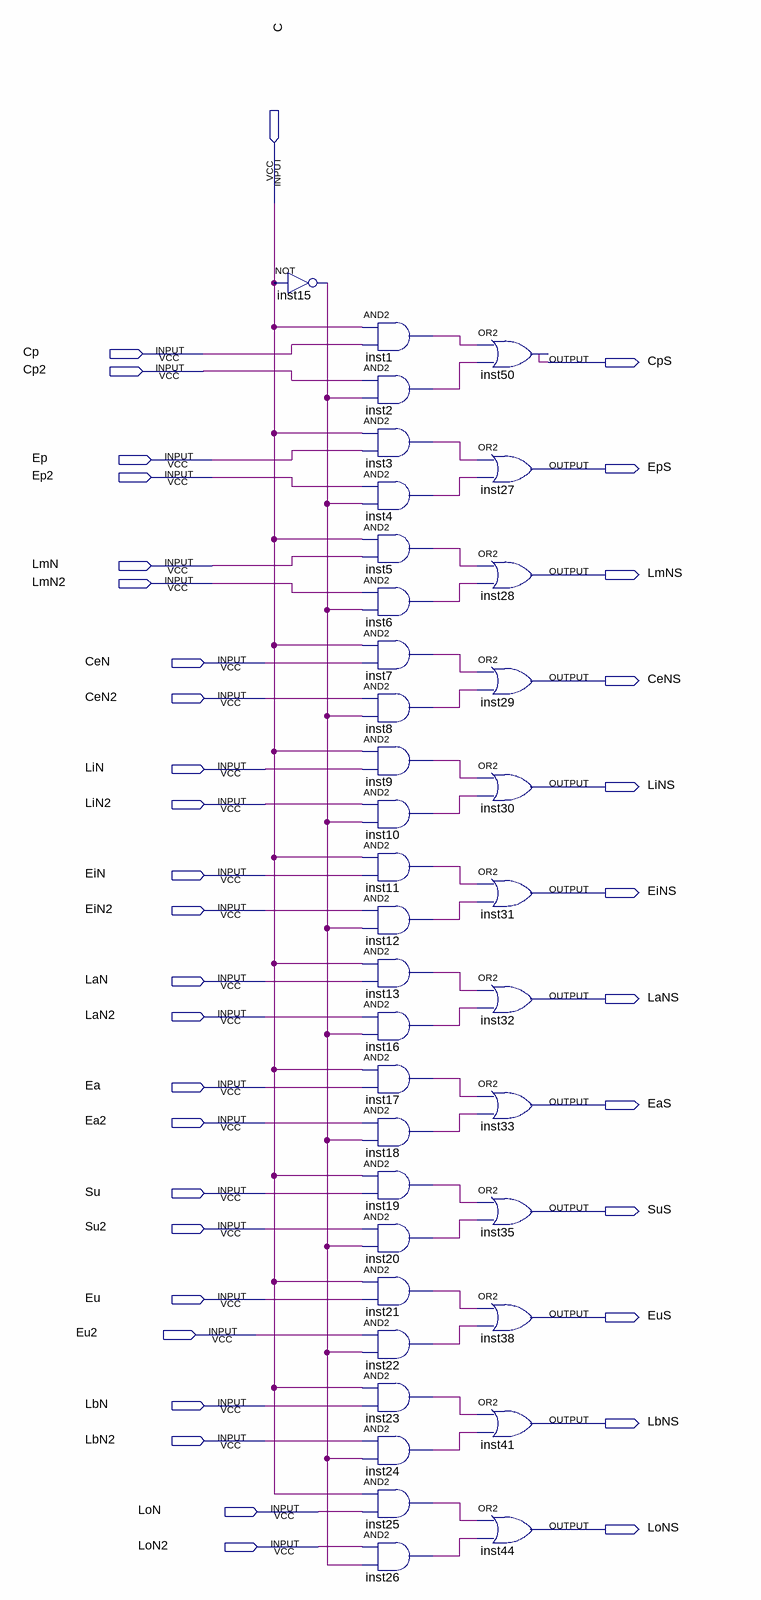
[diagram p0: schematic sheet]
// Quartus schematic decididor.bdf as structural Verilog: 37 symbols, 37 pins
module decididor (
  input  C,
  input  Cp,
  input  Cp2,
  input  Ep,
  input  Ep2,
  input  LmN,
  input  LmN2,
  input  CeN,
  input  CeN2,
  input  LiN,
  input  LiN2,
  input  EiN,
  input  EiN2,
  input  LaN,
  input  LaN2,
  input  Ea,
  input  Ea2,
  input  Su,
  input  Su2,
  input  Eu,
  input  Eu2,
  input  LbN,
  input  LbN2,
  input  LoN,
  input  LoN2,
  output CpS,
  output EpS,
  output LmNS,
  output CeNS,
  output LiNS,
  output EiNS,
  output LaNS,
  output EaS,
  output SuS,
  output EuS,
  output LbNS,
  output LoNS
);

  wire inst1_out, inst2_out, inst3_out, inst4_out, inst5_out, inst6_out, inst7_out, inst8_out, inst9_out,
       inst10_out, inst11_out, inst12_out, inst13_out, inst15_out, inst16_out, inst17_out, inst18_out,
       inst19_out, inst20_out, inst21_out, inst22_out, inst23_out, inst24_out, inst25_out, inst26_out;

  not inst15 (inst15_out, C);
  and inst1 (inst1_out, C, Cp);
  and inst2 (inst2_out, Cp2, inst15_out);
  and inst3 (inst3_out, C, Ep);
  and inst4 (inst4_out, Ep2, inst15_out);
  and inst5 (inst5_out, C, LmN);
  and inst6 (inst6_out, LmN2, inst15_out);
  and inst7 (inst7_out, C, CeN);
  and inst8 (inst8_out, CeN2, inst15_out);
  and inst9 (inst9_out, C, LiN);
  and inst10 (inst10_out, LiN2, inst15_out);
  and inst11 (inst11_out, C, EiN);
  and inst12 (inst12_out, EiN2, inst15_out);
  and inst13 (inst13_out, C, LaN);
  and inst16 (inst16_out, LaN2, inst15_out);
  and inst17 (inst17_out, C, Ea);
  and inst18 (inst18_out, Ea2, inst15_out);
  and inst19 (inst19_out, C, Su);
  and inst20 (inst20_out, Su2, inst15_out);
  and inst21 (inst21_out, C, Eu);
  and inst22 (inst22_out, Eu2, inst15_out);
  and inst23 (inst23_out, C, LbN);
  and inst24 (inst24_out, LbN2, inst15_out);
  and inst25 (inst25_out, C, LoN);
  and inst26 (inst26_out, LoN2, inst15_out);
  or inst50 (CpS, inst1_out, inst2_out);
  or inst27 (EpS, inst3_out, inst4_out);
  or inst28 (LmNS, inst5_out, inst6_out);
  or inst29 (CeNS, inst7_out, inst8_out);
  or inst30 (LiNS, inst9_out, inst10_out);
  or inst31 (EiNS, inst11_out, inst12_out);
  or inst32 (LaNS, inst13_out, inst16_out);
  or inst33 (EaS, inst17_out, inst18_out);
  or inst35 (SuS, inst19_out, inst20_out);
  or inst38 (EuS, inst21_out, inst22_out);
  or inst41 (LbNS, inst23_out, inst24_out);
  or inst44 (LoNS, inst25_out, inst26_out);
endmodule
